# EAGLE design BOSS-Ion-Pump-Interface (EAGLE 9.6.2)
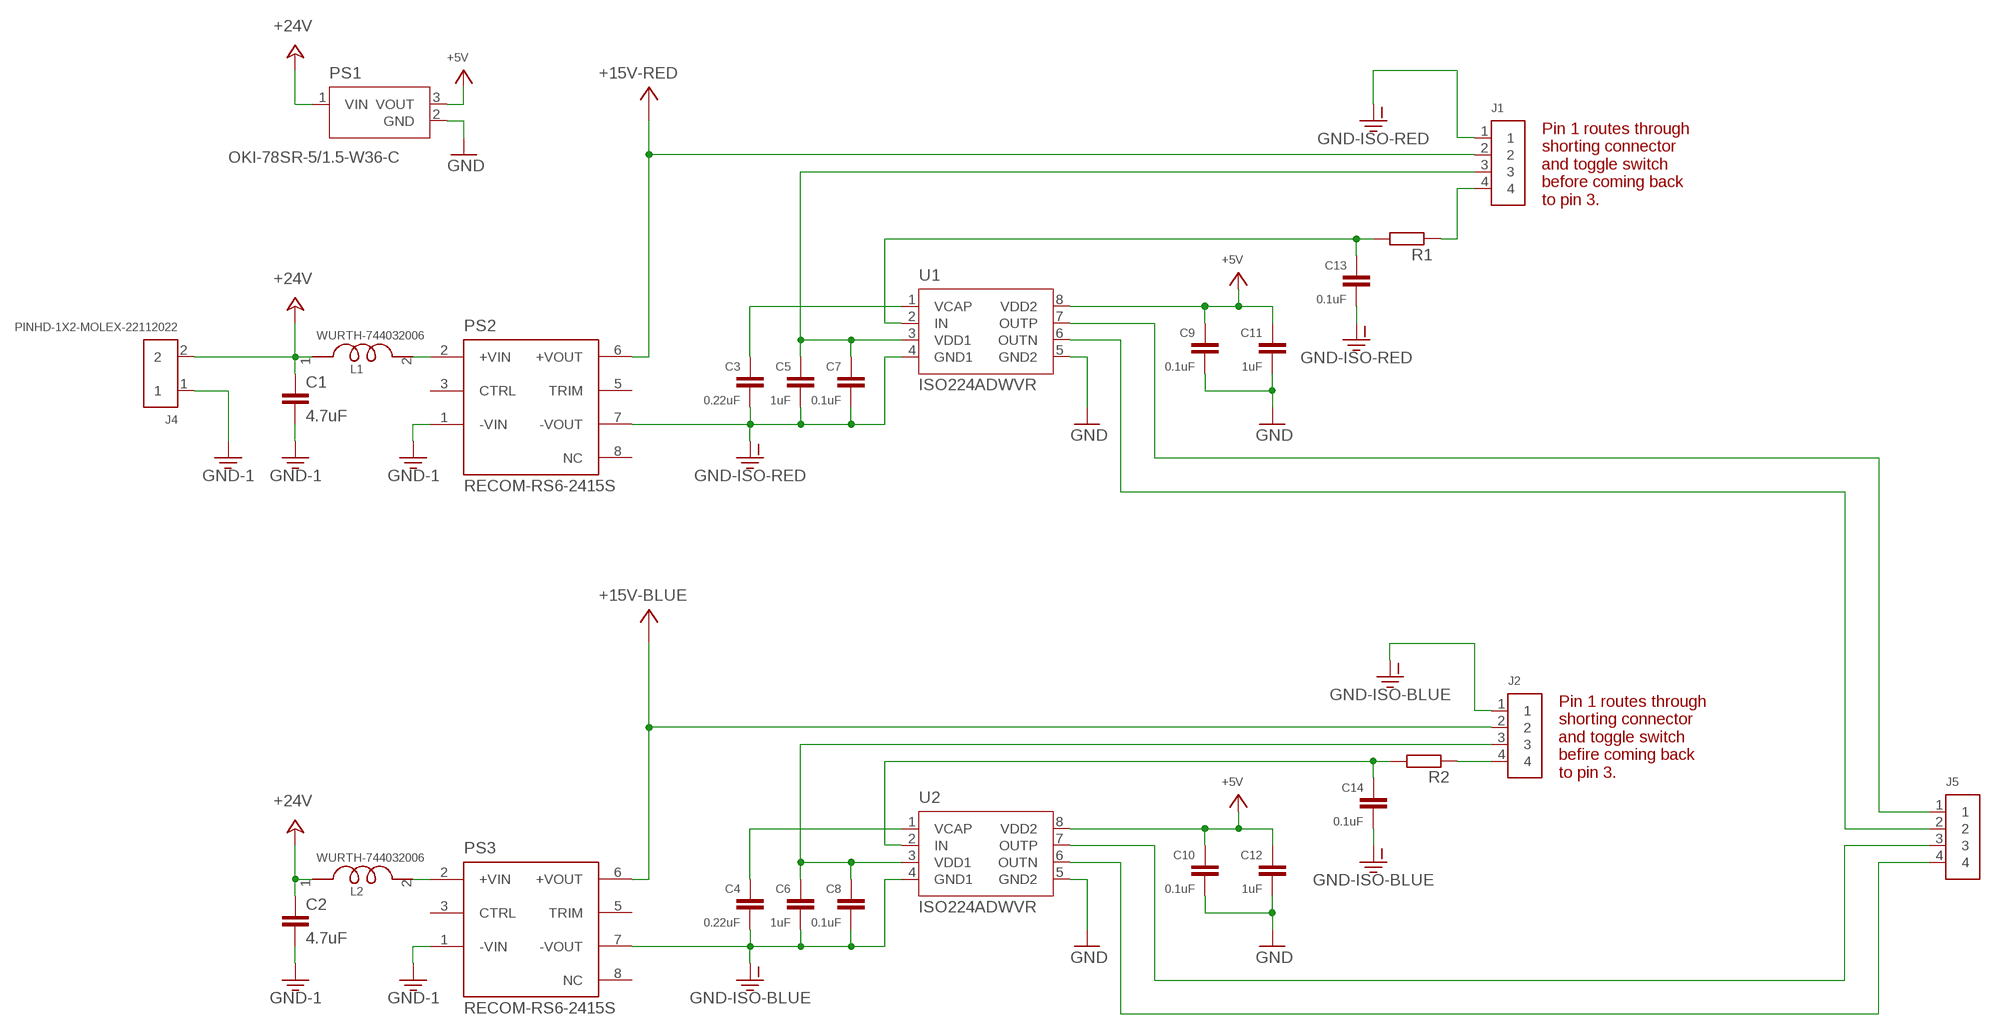
[diagram p0: schematic, sheet 1]

## Parts
C1  4.7uF  C-EUC1206  [C1206]
C2  4.7uF  C-EUC1206  [C1206]
C3  0.22uF  C-EUC0805  [C0805]
C4  0.22uF  C-EUC0805  [C0805]
C5  1uF  C-EUC0805  [C0805]
C6  1uF  C-EUC0805  [C0805]
C7  0.1uF  C-EUC0805  [C0805]
C8  0.1uF  C-EUC0805  [C0805]
C9  0.1uF  C-EUC0805  [C0805]
C10  0.1uF  C-EUC0805  [C0805]
C11  1uF  C-EUC0805  [C0805]
C12  1uF  C-EUC0805  [C0805]
C13  0.1uF  C-EUC0805  [C0805]
C14  0.1uF  C-EUC0805  [C0805]
J1  PINHD-1X4-MOLEX-22112042  [1X04-MOLEX-22112042]
J2  PINHD-1X4-MOLEX-22112042  [1X04-MOLEX-22112042]
J4  PINHD-1X2-MOLEX-22112022  [1X02-MOLEX-22112022]
J5  PINHD-1X4-MOLEX-22112042  [1X04-MOLEX-22112042]
L1  WURTH-744032006  INDUCTOR-WURTH-744032006  [WURTH-1210-INDUCTOR]
L2  WURTH-744032006  INDUCTOR-WURTH-744032006  [WURTH-1210-INDUCTOR]
PS1  OKI-78SR-5/1.5-W36-C  [CONV_OKI-78SR-5/1.5-W36-C]
PS2  RECOM-RS6-2415S  DC-DC-15V-RECOM-RS6-2415S  [CONV_RS6-2415S]
PS3  RECOM-RS6-2415S  DC-DC-15V-RECOM-RS6-2415S  [CONV_RS6-2415S]
R1  R-EU_R0805  [R0805]
R2  R-EU_R0805  [R0805]
U1  ISO224ADWVR  [DWV8_TEX]
U2  ISO224ADWVR  [DWV8_TEX]

## Nets
+5V: C9.1 C10.1 C11.1 C12.1 PS1.3(VOUT) U1.8(VDD2) U2.8(VDD2)
+15V-BLUE: J2.2 PS3.6(+VOUT)
+15V-RED: J1.2 PS2.6(+VOUT)
+24V: C1.1 C2.1 J4.2 L1.1 L2.1 PS1.1(VIN)
BLUE+: J5.3 U2.7(OUTP)
BLUE-: J5.4 U2.6(OUTN)
GND: C9.2 C10.2 C11.2 C12.2 PS1.2(GND) U1.5(GND2) U2.5(GND2)
GND-1: C1.2 C2.2 J4.1 PS2.1(-VIN) PS3.1(-VIN)
GND-ISO-1: C3.2 C5.2 C7.2 C13.2 J1.1 PS2.7(-VOUT) U1.4(GND1) ; supply symbol labelled GND-ISO-RED
GND-ISO-2: C4.2 C6.2 C8.2 C14.2 J2.1 PS3.7(-VOUT) U2.4(GND1) ; supply symbol labelled GND-ISO-BLUE
IN-BLUE: C14.1 R2.2 U2.2(IN)
IN-RED: C13.1 R1.2 U1.2(IN)
N$2: C3.1 U1.1(VCAP)
N$4: L1.2 PS2.2(+VIN)
N$5: J1.4 R1.1
N$6: C4.1 U2.1(VCAP)
N$9: L2.2 PS3.2(+VIN)
N$14: J2.4 R2.1
RED+: J5.1 U1.7(OUTP)
RED-: J5.2 U1.6(OUTN)
VDD1-BLUE: C6.1 C8.1 J2.3 U2.3(VDD1)
VDD1-RED: C5.1 C7.1 J1.3 U1.3(VDD1)
Unconnected: PS2.3(CTRL) PS2.5(TRIM) PS2.8(NC) PS3.3(CTRL) PS3.5(TRIM) PS3.8(NC)

## Notes on the sheet
- Pin 1 routes through
  shorting connector
  and toggle switch
  before coming back
  to pin 3.
- Pin 1 routes through
  shorting connector
  and toggle switch
  befire coming back
  to pin 3.

## Library data of the parts
C1-C14 = AUmlib:C-EU: CAPACITOR, European symbol; SPICEPREFIX: C
J1 J2 J5 = AUmlib:PINHD-1X4-MOLEX-22112042
J4 = AUmlib:PINHD-1X2-MOLEX-22112022
L1 L2 = AUmlib:INDUCTOR-WURTH-744032006
PS1 = AUmlib:OKI-78SR-5/1.5-W36-C: OKI Series 8 W Single Output 5 V Non Isolated Through Hole DC/DC Converter; DESCRIPTION: Linear Regulator Replacement DC DC Converter 1 Output 5V 1.5A 7V - 36V Input; DIGI-KEY_PART_NUMBER: 811-2196-5-ND; MF: Murata Power Solutions Inc.; MP: OKI-78SR-5/1.5-W36-C; PACKAGE: SIP-3 Murata Power; PURCHASE-URL: https://pricing.snapeda.com/search/part/OKI-78SR-5/1.5-W36-C/?ref=eda
PS2 PS3 = AUmlib:DC-DC-15V-RECOM-RS6-2415S: 6 Watt SIP8 Single and Dual Output; DESCRIPTION: 6W DC/DC-Converter 'ECONOLINE' SIP8 2kV reg 2:1; DIGI-KEY_PART_NUMBER: 945-2987-ND; MF: Recom Power; MP: RS6-2415S; PACKAGE: SIP-8 Recom Power; PURCHASE-URL: https://pricing.snapeda.com/search/part/RS6-2415S/?ref=eda
R1 R2 = AUmlib:R-EU_: RESISTOR, European symbol; SPICEPREFIX: R
U1 U2 = AUmlib:ISO224ADWVR; BUILT_BY: EMA_Jessica; COPYRIGHT: Copyright (C) 2018 Accelerated Designs. All rights reserved; MANUFACTURER_PART_NUMBER: ISO224ADWVR; SOURCELIBRARY: TI_2020-05-18; VENDOR: Texas Instruments

## Board
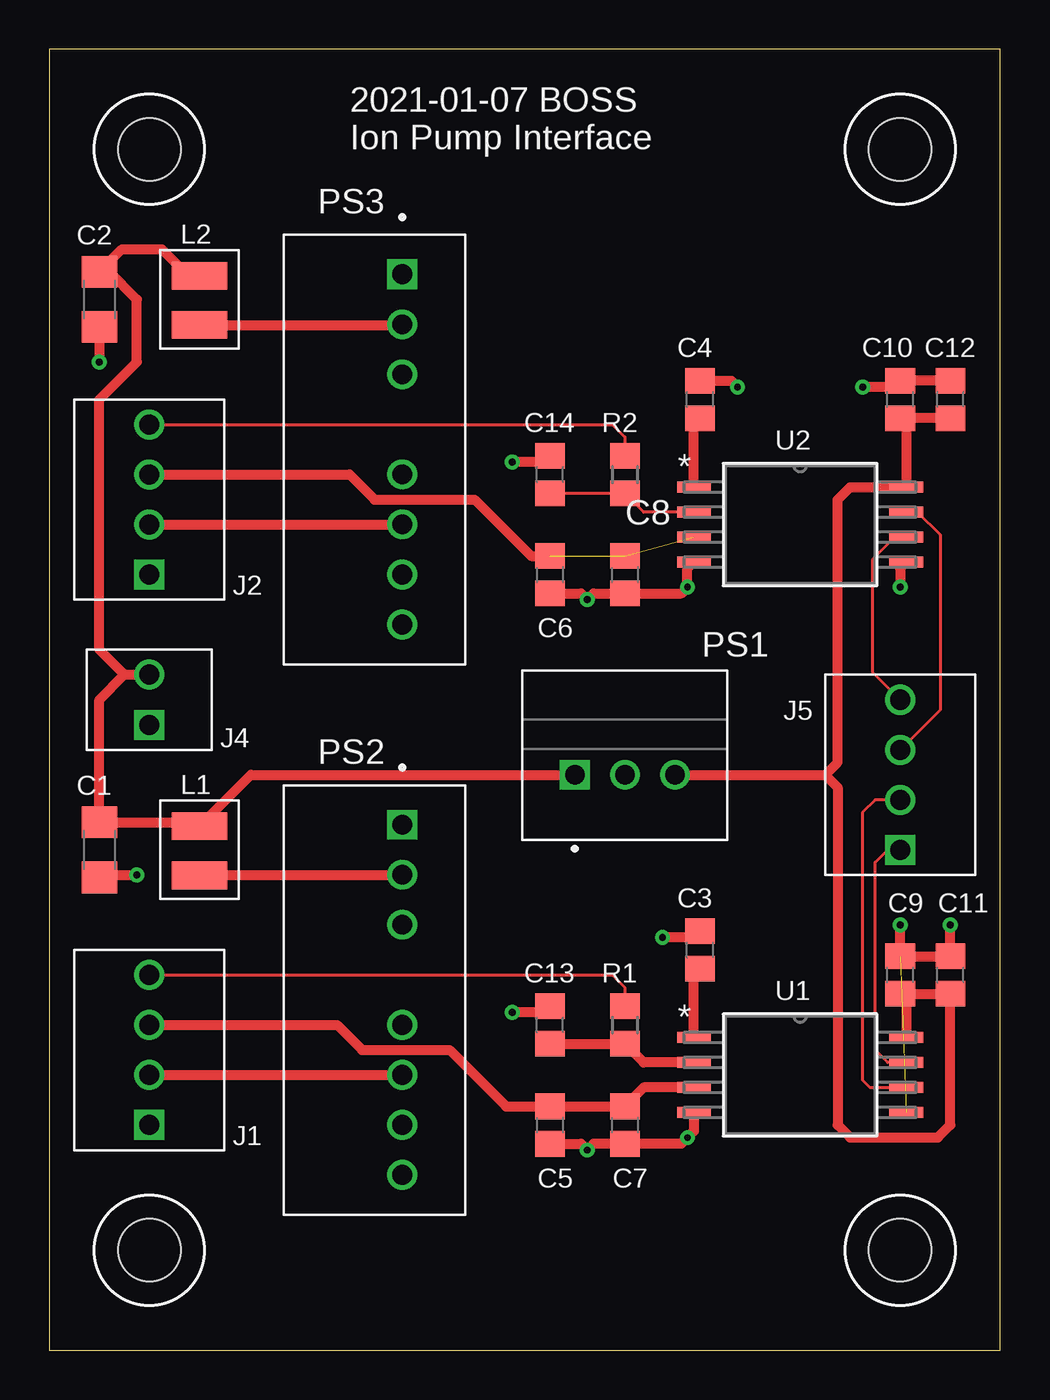
[diagram p1: board, top side]
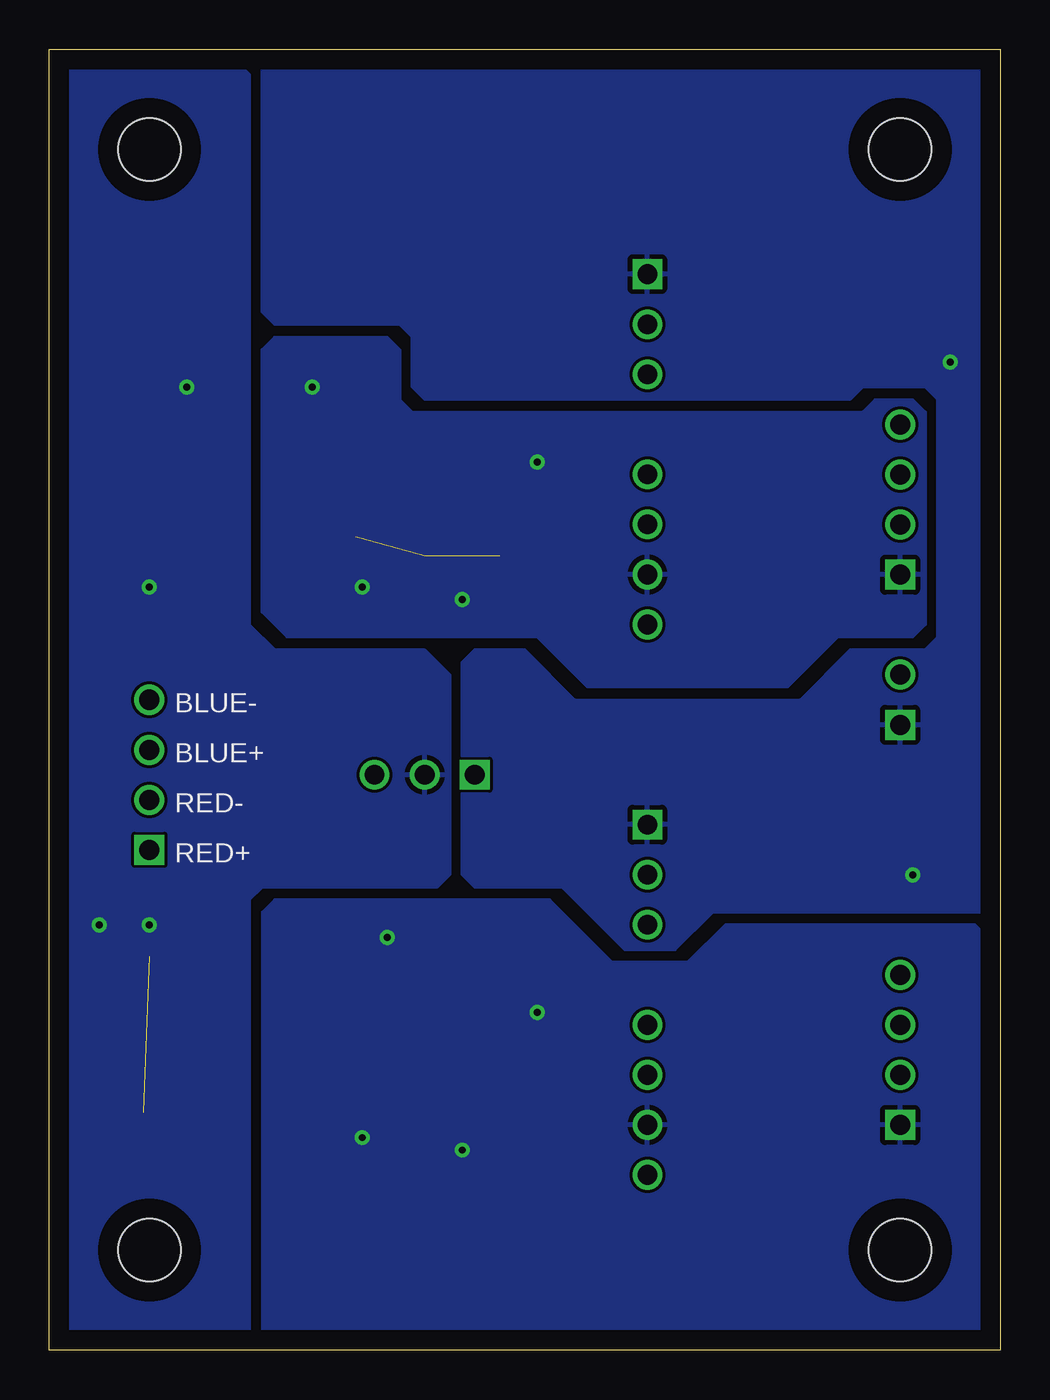
[diagram p2: board, bottom side, seen from below]

Size 48.26 x 66.04 mm. Coordinates in mm from the lower left corner, seen from the top.
Outline: 0,0 48.26,0 48.26,66.04 0,66.04 0,0
Copper layers (1*16): Top 0.035mm / dielectric 1.5mm / Bottom 0.035mm
Design rules "default": minimum track width 6mil, minimum drill 0.35mm, track to track 6mil, track to pad 6mil, pad to pad 6mil, via to via 6mil, smd to smd 6mil, copper to edge 40mil, drill to drill 6mil, minimum pad ring 10mil, minimum via ring 8mil, stop-mask expansion 4mil, vias tented up to drill 0mil, thermal gap 10mil
Holes 3.17 mm at 5.08,5.08 5.08,60.96 43.18,5.08 43.18,60.96

### Footprints (pad centres in the part's own frame; a part is rotated, then mirrored left to right if it is on the bottom)
C1206 = smd 1.6 x 1.8: 1 -1.4,0; 2 1.4,0
C0805 = smd 1.3 x 1.5: 1 -0.95,0; 2 0.95,0
1X04-MOLEX-22112042 = drill 1.016 square: 1 0,0 | drill 1.016: 2 2.54,0; 3 5.08,0; 4 7.62,0
1X02-MOLEX-22112022 = drill 1.016 square: 1 -1.27,0 | drill 1.016: 2 1.27,0
WURTH-1210-INDUCTOR = smd 1.4 x 2.8: 1 -1.2,0; 2 1.3,0
CONV_OKI-78SR-5/1.5-W36-C = drill 1 pad 1.5 square: 1 -2.54,0 | drill 1 pad 1.5: 2 0,0; 3 2.54,0
CONV_RS6-2415S = drill 1 square: 1 -8.9,1.4 | drill 1: 2 -6.36,1.4; 3 -3.82,1.4; 5 1.26,1.4; 6 3.8,1.4; 7 6.34,1.4; 8 8.88,1.4
R0805 = smd 1.3 x 1.5: 1 -0.95,0; 2 0.95,0
DWV8_TEX = smd 1.702 x 0.559: 1 -5.385,1.905; 2 -5.385,0.635; 3 -5.385,-0.635; 4 -5.385,-1.905; 5 5.385,-1.905; 6 5.385,-0.635; 7 5.385,0.635; 8 5.385,1.905

### Placement (x,y rotation side)
C1  2.54,25.4 270 top
C2  2.54,53.34 270 top
C3  33.02,20.32 90 top
C4  33.02,48.26 90 top
C5  25.4,11.43 270 top
C6  25.4,39.37 270 top
C7  29.21,11.43 270 top
C8  29.21,39.37 270 top
C9  43.18,19.05 90 top
C10  43.18,48.26 90 top
C11  45.72,19.05 90 top
C12  45.72,48.26 90 top
C13  25.4,16.51 90 top
C14  25.4,44.45 90 top
J1  5.08,11.43 90 top
J2  5.08,39.37 90 top
J4  5.08,33.02 90 top
J5  43.18,25.4 90 top
L1  7.62,25.4 270 top
L2  7.62,53.34 270 top
PS1  29.21,29.21 0 top
PS2  16.51,17.78 270 top
PS3  16.51,45.72 270 top
R1  29.21,16.51 270 top
R2  29.21,44.45 270 top
U1  38.1,13.97 0 top
U2  38.1,41.91 0 top

### Tracks (layer width: path | path; a pad name or v marks a point on that pad's centre or on a via)
+5V
  Top 0.508: U1.8 43.48,17.8 C9.1 C11.1 45.72,11.43 45.09,10.79 40.64,10.79 40.01,11.43 40.01,28.57 39.37,29.21 | C12.1 C10.1 43.48,47.01 U2.8 40.64,43.81 40.01,43.18 40.01,29.84 39.37,29.21 | PS1.3 39.37,29.21
+15V-BLUE
  Top 0.508: J2.2 PS3.6
+15V-RED
  Top 0.508: J1.2 PS2.6
+24V
  Top 0.508: PS1.1 10.23,29.21 L1.1 7.42,26.8 C1.1 2.54,33.02 3.81,34.29 | 3.81,34.29 J4.2 | 7.42,54.74 L2.1 7.05,54.54 5.71,55.88 3.68,55.88 C2.1 3.04,54.74 4.45,53.34 4.45,50.16 2.54,48.26 2.54,35.56 3.81,34.29
BLUE+
  Top 0.152: U2.7 44.06,42.55 45.2,41.4 45.2,32.5 J5.3
BLUE-
  Top 0.152: U2.6 42.91,41.27 41.77,40.13 41.77,34.43 J5.4
GND  (via drill 0.35)  (1 unrouted)
  Top 0.508: v41.27,48.9 42.87,48.9 C10.2 C12.2 | U2.5 43.18,39.7 v43.18,38.73 | v43.18,21.59 C9.2 C11.2 v45.72,21.59
  pour Bottom: 48.26,0 48.26,66.04 39.37,66.04 38.1,64.77 38.1,36.83 36.83,35.56 29.21,35.56 27.94,34.29 27.94,24.13 28.57,23.5 37.47,23.5 38.1,22.86 38.1,0.64 38.73,0
GND-1  (via drill 0.35)
  Top 0.508: C1.2 2.67,24.13 v4.45,24.13 | C2.2 v2.54,50.16
  pour Bottom: 0,22.86 0.64,22.23 14.61,22.23 16.51,20.32 19.05,20.32 22.23,23.5 26.67,23.5 27.3,24.13 27.3,34.92 26.67,35.56 24.13,35.56 21.59,33.02 10.79,33.02 10.16,33.02 7.62,35.56 3.81,35.56 3.17,36.2 3.17,48.26 3.81,48.9 6.99,48.9 7.62,48.26 29.21,48.26 29.84,48.9 29.84,51.44 30.48,52.07 36.83,52.07 37.47,52.7 37.47,65.41 36.83,66.04 0,66.04
GND-ISO-1  (via drill 0.35)
  Top 0.508: U1.4 32.72,11.12 v32.38,10.79 32.07,10.48 C7.2 27.62,10.48 v27.3,10.16 26.98,10.48 C5.2 | C3.2 32.7,20.95 v31.11,20.95 | C13.2 25.09,17.14 v23.5,17.14
  pour Bottom: 0,0 0,20.32 1.27,21.59 13.97,21.59 15.88,19.68 19.68,19.68 22.86,22.86 36.83,22.86 37.47,22.23 37.47,0.64 36.83,0
GND-ISO-2  (via drill 0.35)
  Top 0.508: C6.2 26.98,38.42 v27.3,38.1 27.62,38.42 C8.2 32.07,38.42 v32.38,38.73 32.38,39.67 U2.4 | C4.2 34.61,49.21 v34.92,48.9 | C14.2 25.09,45.09 v23.5,45.09
  pour Bottom: 36.2,36.2 37.47,37.47 37.47,50.8 36.83,51.44 31.11,51.44 30.48,50.8 30.48,48.26 29.84,47.62 6.99,47.62 6.35,48.26 4.45,48.26 3.81,47.62 3.81,36.83 4.45,36.2 8.26,36.2 10.79,33.66 20.95,33.66 23.5,36.2
IN-BLUE
  Top 0.152: U2.2 30.16,42.55 R2.2 C14.1
IN-RED
  Top 0.508: U1.2 30.16,14.61 R1.2 C13.1
N$2
  Top 0.508: U1.1 32.72,19.07 C3.1
N$4
  Top 0.508: L1.2 7.66,24.14 PS2.2
N$5
  Top 0.152: J1.4 28.57,19.05 29.21,18.41 R1.1
N$6
  Top 0.508: U2.1 32.72,47.01 C4.1
N$9
  Top 0.508: L2.2 17.87,52.04 PS3.2
N$14
  Top 0.152: J2.4 28.57,46.99 29.21,46.35 R2.1
RED+
  Top 0.152: 42.91,14.61 U1.7 42.55,14.61 41.91,15.24 41.91,24.77 42.55,25.4 J5.1
RED-
  Top 0.152: J5.2 41.91,27.94 41.26,27.29 41.26,13.72 41.64,13.34 U1.6
VDD1-BLUE  (2 unrouted)
  Top 0.508: J2.3 15.24,44.45 16.51,43.18 21.59,43.18 24.45,40.32 C6.1
VDD1-RED
  Top 0.508: U1.3 30.16,13.34 C7.1 C5.1 23.18,12.38 20.32,15.24 15.88,15.24 14.61,16.51 J1.3

### Text on the board
tPlace: 2021-01-07 BOSS / Ion Pump Interface
bPlace: BLUE- | BLUE+ | RED- | RED+